# Altium project Circuitry1.PrjPcb
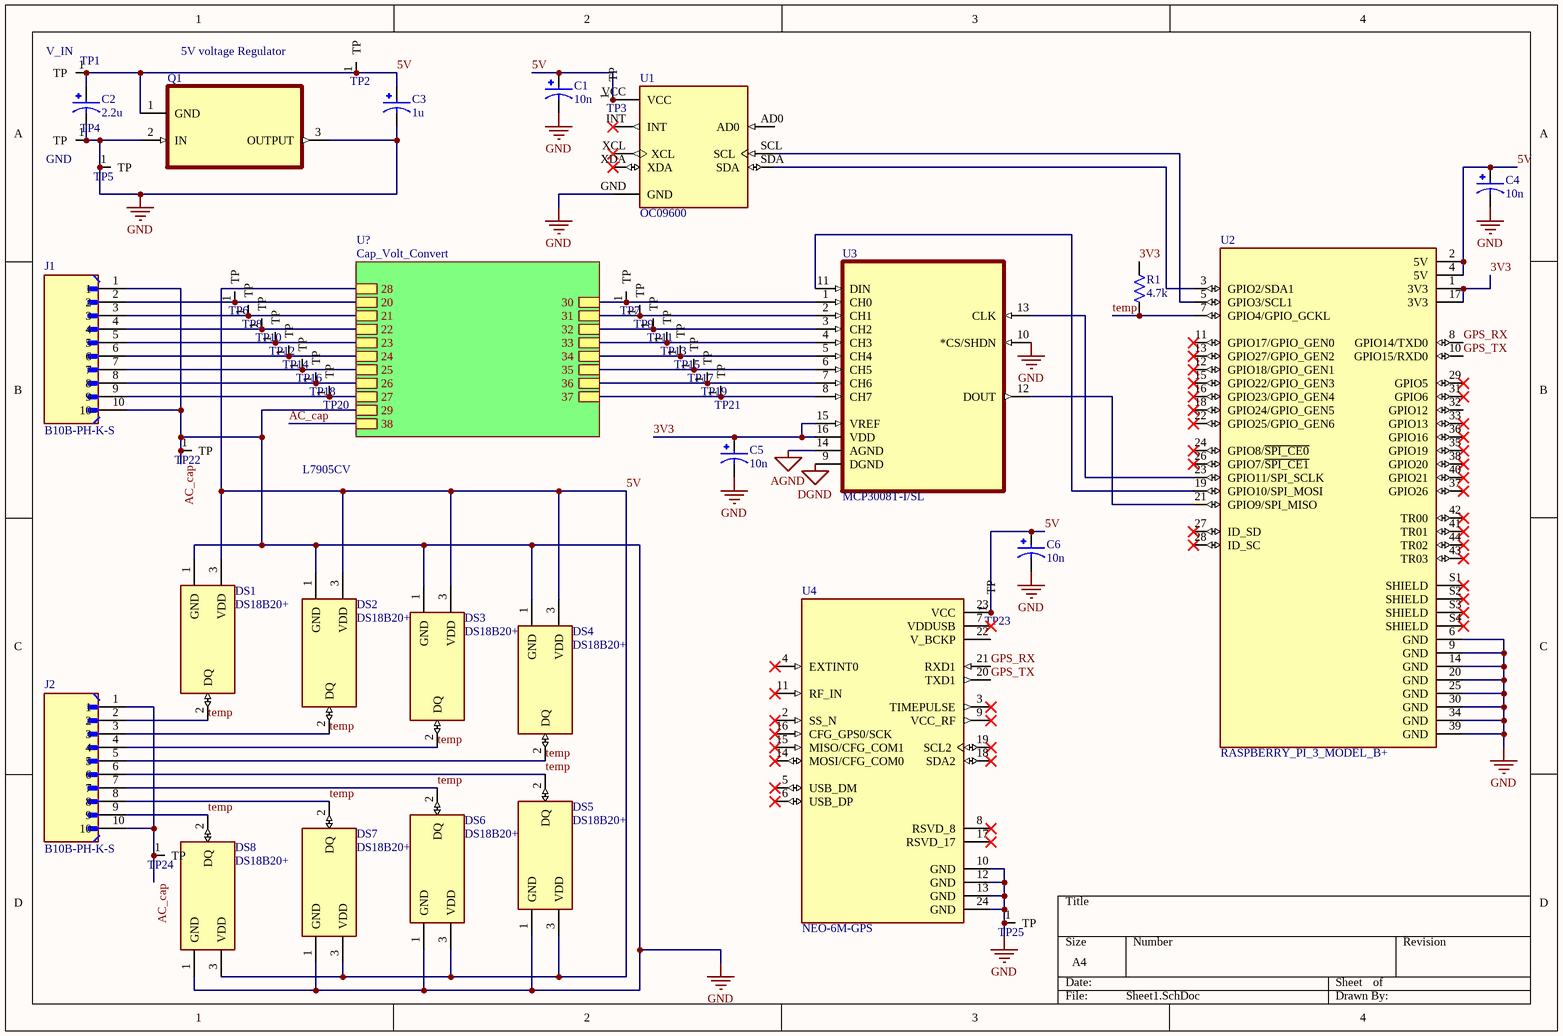
[diagram p0: Sheet1.SchDoc]
3 sheets, 101 parts. Net scope: hierarchical (ports join the sheet entries above them; power ports are global).
Board file: PCB1.PcbDoc
Sheets:
  Sheet1.SchDoc
    U? = Cap_Volt_Convert.SchDoc
      U = High-FrequencyOp-AmpTransimpedanceCircuit.SchDoc
      U = High-FrequencyOp-AmpTransimpedanceCircuit.SchDoc
      U = High-FrequencyOp-AmpTransimpedanceCircuit.SchDoc
      U = High-FrequencyOp-AmpTransimpedanceCircuit.SchDoc
      U = High-FrequencyOp-AmpTransimpedanceCircuit.SchDoc
      U = High-FrequencyOp-AmpTransimpedanceCircuit.SchDoc
      U = High-FrequencyOp-AmpTransimpedanceCircuit.SchDoc
      U = High-FrequencyOp-AmpTransimpedanceCircuit.SchDoc

## Sheet Sheet1.SchDoc
size A4; Author: Samiru Nuwanaka; DrawnBy: Samiru Nuwanaka; Engineer: Samiru Nuwanaka; SheetNumber: 1; SheetTotal: 3

### Parts
C1  10n  [CAPPRD750W80D1600H2000]
C2  2.2u  [CAPPRD750W80D1600H2000]
C3  1u  [CAPPRD750W80D1600H2000]
C4  10n  [CAPPRD750W80D1600H2000]
C5  10n  [CAPPRD750W80D1600H2000]
C6  10n  [CAPPRD750W80D1600H2000]
DS1  DS18B20+  [IC_DS18B20+]
DS2  DS18B20+  [IC_DS18B20+]
DS3  DS18B20+  [IC_DS18B20+]
DS4  DS18B20+  [IC_DS18B20+]
DS5  DS18B20+  [IC_DS18B20+]
DS6  DS18B20+  [IC_DS18B20+]
DS7  DS18B20+  [IC_DS18B20+]
DS8  DS18B20+  [IC_DS18B20+]
J1  B10B-PH-K-S  [JST_B10B-PH-K-S]
J2  B10B-PH-K-S  [JST_B10B-PH-K-S]
Q1  L7905CV  [TO254P450X1020X1935-3P]
R1  4.7k  [RESAD730W45L370D210]
TP1  V_IN  [Testpoint]  (net tie, no BOM)
TP2  Testpoint  [Testpoint SMD]  (value not drawn)  (net tie, no BOM)
TP3  Testpoint  [Testpoint SMD]  (value not drawn)  (net tie, no BOM)
TP4  GND  [Testpoint]  (net tie, no BOM)
TP5  Testpoint  [Testpoint SMD]  (value not drawn)  (net tie, no BOM)
TP6  Testpoint  [Testpoint SMD]  (value not drawn)  (net tie, no BOM)
TP7  Testpoint  [Testpoint SMD]  (value not drawn)  (net tie, no BOM)
TP8  Testpoint  [Testpoint SMD]  (value not drawn)  (net tie, no BOM)
TP9  Testpoint  [Testpoint SMD]  (value not drawn)  (net tie, no BOM)
TP10  Testpoint  [Testpoint SMD]  (value not drawn)  (net tie, no BOM)
TP11  Testpoint  [Testpoint SMD]  (value not drawn)  (net tie, no BOM)
TP12  Testpoint  [Testpoint SMD]  (value not drawn)  (net tie, no BOM)
TP13  Testpoint  [Testpoint SMD]  (value not drawn)  (net tie, no BOM)
TP14  Testpoint  [Testpoint SMD]  (value not drawn)  (net tie, no BOM)
TP15  Testpoint  [Testpoint SMD]  (value not drawn)  (net tie, no BOM)
TP16  Testpoint  [Testpoint SMD]  (value not drawn)  (net tie, no BOM)
TP17  Testpoint  [Testpoint SMD]  (value not drawn)  (net tie, no BOM)
TP18  Testpoint  [Testpoint SMD]  (value not drawn)  (net tie, no BOM)
TP19  Testpoint  [Testpoint SMD]  (value not drawn)  (net tie, no BOM)
TP20  Testpoint  [Testpoint SMD]  (value not drawn)  (net tie, no BOM)
TP21  Testpoint  [Testpoint SMD]  (value not drawn)  (net tie, no BOM)
TP22  Testpoint  [Testpoint]  (value not drawn)  (net tie, no BOM)
TP23  Testpoint  [Testpoint SMD]  (value not drawn)  (net tie, no BOM)
TP24  Testpoint  [Testpoint SMD]  (value not drawn)  (net tie, no BOM)
TP25  Testpoint  [Testpoint SMD]  (value not drawn)  (net tie, no BOM)
U1  OC09600  [MODULE_OC09600]
U2  RASPBERRY_PI_3_MODEL_B+  [MODULE_RASPBERRY_PI_3_MODEL_B+]
U3  MCP3008T-I/SL  [SOIC127P600X175-16N]
U4  NEO-6M-GPS  [XCVR_NEO-6M-GPS]

### Sub-sheets
U? = Cap_Volt_Convert: 20, 21, 22, 23, 24, 25, 26, 27, 28, 29, 30, 31, 32, 33, 34, 35, 36, 37, 38

### Nets
AC_cap: C1.N C2.N C3.N C4.N C5.N C6.N DS1.1(GND) DS2.1(GND) DS3.1(GND) DS4.1(GND) DS5.1(GND) DS6.1(GND) DS7.1(GND) DS8.1(GND) J1.1 J1.10 J2.1 J2.10 Q1.2(IN) Q1.3(OUTPUT) TP4.1(TP) TP5.1(TP) TP22.1(TP) TP24.1(TP) TP25.1(TP) U1.GND U2.6(GND) U2.9(GND) U2.14(GND) U2.20(GND) U2.25(GND) U2.30(GND) U2.34(GND) U2.39(GND) U3.10(*CS/SHDN) U4.10(GND) U4.12(GND) U4.13(GND) U4.24(GND) ; sheet U?/29, sheet U?/38  [also labelled GND]
AGND: U3.14(AGND)
DGND: U3.9(DGND)
3V3: C5.P R1.2 U2.1(3V3) U2.17(3V3) U3.15(VREF) U3.16(VDD)
5V: C1.P C2.P C3.P C4.P C6.P DS1.3(VDD) DS2.3(VDD) DS3.3(VDD) DS4.3(VDD) DS5.3(VDD) DS6.3(VDD) DS7.3(VDD) DS8.3(VDD) Q1.1(GND) TP1.1(TP) TP2.1(TP) TP3.1(TP) TP23.1(TP) U1.VCC U2.2(5V) U2.4(5V) U4.23(VCC) ; sheet U?/28
GPS_RX: U2.8(GPIO14/TXD0) U4.21(RXD1)
GPS_TX: U2.10(GPIO15/RXD0) U4.20(TXD1)
temp: DS1.2(DQ) DS2.2(DQ) DS3.2(DQ) DS4.2(DQ) DS5.2(DQ) DS6.2(DQ) DS7.2(DQ) DS8.2(DQ) J2.2 J2.3 J2.4 J2.5 J2.6 J2.7 J2.8 J2.9 R1.1 U2.7(GPIO4/GPIO_GCKL)
NetC10_U?_U#1_P: J1.2 TP6.1(TP) ; sheet U?/20
NetC10_U?_U#3_P: J1.6 TP14.1(TP) ; sheet U?/24
NetC10_U?_U#4_P: J1.7 TP16.1(TP) ; sheet U?/25
NetC10_U?_U#5_P: J1.8 TP18.1(TP) ; sheet U?/26
NetC10_U?_U#6_P: J1.9 TP20.1(TP) ; sheet U?/27
NetC10_U?_U#7_P: J1.3 TP8.1(TP) ; sheet U?/21
NetC10_U?_U#8_P: J1.5 TP12.1(TP) ; sheet U?/23
NetC11_U?_U#1_P: TP7.1(TP) U3.1(CH0) ; sheet U?/30
NetC11_U?_U#2_P: TP11.1(TP) U3.3(CH2) ; sheet U?/32
NetC11_U?_U#3_P: TP15.1(TP) U3.5(CH4) ; sheet U?/34
NetC11_U?_U#4_P: TP17.1(TP) U3.6(CH5) ; sheet U?/35
NetC11_U?_U#5_P: TP19.1(TP) U3.7(CH6) ; sheet U?/36
NetC11_U?_U#6_P: TP21.1(TP) U3.8(CH7) ; sheet U?/37
NetC11_U?_U#7_P: TP9.1(TP) U3.2(CH1) ; sheet U?/31
NetC11_U?_U#8_P: TP13.1(TP) U3.4(CH3) ; sheet U?/33
NetJ1_4: J1.4 TP10.1(TP) ; sheet U?/22
NetU1_SCL: U1.SCL U2.5(GPIO3/SCL1)
NetU1_SDA: U1.SDA U2.3(GPIO2/SDA1)
NetU2_19: U2.19(GPIO10/SPI_MOSI) U3.11(DIN)
NetU2_21: U2.21(GPIO9/SPI_MISO) U3.12(DOUT)
NetU2_23: U2.23(GPIO11/SPI_SCLK) U3.13(CLK)

Not connected (* = marked no-connect by the designer): U1 AD0 INT* XCL* XDA*; U2 11(GPIO17/GPIO_GEN0)* 12(GPIO18/GPIO_GEN1)* 13(GPIO27/GPIO_GEN2)* 15(GPIO22/GPIO_GEN3)* 16(GPIO23/GPIO_GEN4)* 18(GPIO24/GPIO_GEN5)* 22(GPIO25/GPIO_GEN6)* 24(GPIO8/~{SPI_CE0})* 26(GPIO7/~{SPI_CE1})* 27(ID_SD)* 28(ID_SC)* 29(GPIO5)* 31(GPIO6)* 32(GPIO12) 33(GPIO13)* 35(GPIO19)* 36(GPIO16)* 37(GPIO26)* 38(GPIO20)* 40(GPIO21)* 41(TR01)* 42(TR00)* 43(TR03)* 44(TR02)* S1(SHIELD)* S2(SHIELD)* S3(SHIELD)* S4(SHIELD)*; U4 2(SS_N)* 3(TIMEPULSE)* 4(EXTINT0)* 5(USB_DM)* 6(USB_DP)* 7(VDDUSB)* 8(RSVD_8)* 9(VCC_RF)* 11(RF_IN)* 14(MOSI/CFG_COM0)* 15(MISO/CFG_COM1)* 16(CFG_GPS0/SCK)* 17(RSVD_17)* 18(SDA2)* 19(SCL2)* 22(V_BCKP)

### Notes on the sheet
- 5V voltage Regulator

### Library data of the parts
C1-C6 = EEUFS1J681S: CAP ALUM 680UF 20% 63V THRU HOLE; MP: EEU-FS1J681S; MF: Panasonic Electronic Components; Package: RADIAL-2 Panasonic; Availability: In Stock; SnapEDA_Link: https://www.snapeda.com/parts/EEU-FS1J681S/Panasonic/view-part/5562022/?ref=snap; Price: None; Check_prices: https://www.snapeda.com/parts/EEU-FS1J681S/Panasonic/view-part/5562022/?ref=eda; Value: *
DS1-DS8 = DS18B20+: Programmable Resolution 1-Wire Digital Thermometer; MF: Analog Devices; SnapEDA_Link: https://www.snapeda.com/parts/DS18B20+/Analog+Devices/view-part/?ref=snap; Package: TO-226-3 Maxim; Value: *; MP: DS18B20+; Check_prices: https://www.snapeda.com/parts/DS18B20+/Analog+Devices/view-part/?ref=eda
J1 J2 = B10B-PH-K-S: 2.0 mm pitch/Disconnectable Crimp style connectors; MF: JST Sales America Inc.; SnapEDA_Link: https://www.snapeda.com/parts/B10B-PH-K-S/JST/view-part/?ref=snap; Package: None; Value: *; MP: B10B-PH-K-S; Check_prices: https://www.snapeda.com/parts/B10B-PH-K-S/JST/view-part/?ref=eda
Q1 = L7905CV: Linear Voltage Regulator IC Negative Fixed 1 Output 1.5A TO-220; MF: STMicroelectronics; SnapEDA_Link: https://www.snapeda.com/parts/L7905CV/STMicroelectronics/view-part/?ref=snap; Package: TO-220-3 STMicroelectronics; Value: *; MP: L7905CV; Check_prices: https://www.snapeda.com/parts/L7905CV/STMicroelectronics/view-part/?ref=eda
R1 = MFR-12FTE52-12K5: Metal Film Resistors - Through Hole; MF: YAGEO; SnapEDA_Link: https://www.snapeda.com/parts/MFR-12FTE52-12K5/Yageo/view-part/?ref=snap; Package: RADIAL-2 Yageo; Value: *; MP: MFR-12FTE52-12K5; Check_prices: https://www.snapeda.com/parts/MFR-12FTE52-12K5/Yageo/view-part/?ref=eda
TP1 TP4 = Testpoint
U1 = OC09600: GY-521 6 DOF MPU-6050 Module 3 Axis Accelerometer Gyroscope Module for Arduino; MF: YKS; SnapEDA_Link: https://www.snapeda.com/parts/OC09600/YKS/view-part/?ref=snap; Package: None; Value: *; MP: OC09600; Check_prices: https://www.snapeda.com/parts/OC09600/YKS/view-part/?ref=eda
U2 = RASPBERRY_PI_3_MODEL_B+: Case Plastic, ABS Black Hand Held, Split Sides 3.520 L x 2.740 W (89.41mm x 69.60mm) X 0.980 (24.89mm); MF: Raspberry Pi; MP: RASPBERRY PI 3 MODEL B+; Purchase-URL: https://pricing.snapeda.com/search/part/RASPBERRY PI 3 MODEL B+/?ref=eda; Check_prices: https://www.snapeda.com/parts/RASPBERRY%20PI%203%20MODEL%20B+/Raspberry+Pi/view-part/?ref=eda; SnapEDA_Link: https://www.snapeda.com/parts/RASPBERRY%20PI%203%20MODEL%20B+/Raspberry+Pi/view-part/?ref=snap; Price: None; Availability: In Stock; Package: Raspberry Pi; Value: *
U3 = MCP3008T-I/SL: 10-bit ADC, SPI, 8-channel16 SOIC .150in T/R | Microchip Technology Inc. MCP3008T-I/SL; SnapEDA_Link: https://www.snapeda.com/parts/MCP3008T-I/SL/Microchip/view-part/?ref=snap; Package: SOIC-16 Microchip; Value: *; MF: Microchip Technology; MP: MCP3008T-I/SL; Check_prices: https://www.snapeda.com/parts/MCP3008T-I/SL/Microchip/view-part/?ref=eda
U4 = NEO-6M-GPS: GPS Development Tools SparkFun GNSS-RTK Dead Reckoning Breakout - ZED-F9K (Qwiic); MF: u-blox; SnapEDA_Link: https://www.snapeda.com/parts/NEO-6M-GPS/u-blox/view-part/?ref=snap; MP: NEO-6M-GPS; Availability: Not in stock; Price: None; Check_prices: https://www.snapeda.com/parts/NEO-6M-GPS/u-blox/view-part/?ref=eda; Value: *; Package: None

## Sheet Cap_Volt_Convert.SchDoc
size A4; SheetNumber: 2; SheetTotal: 3
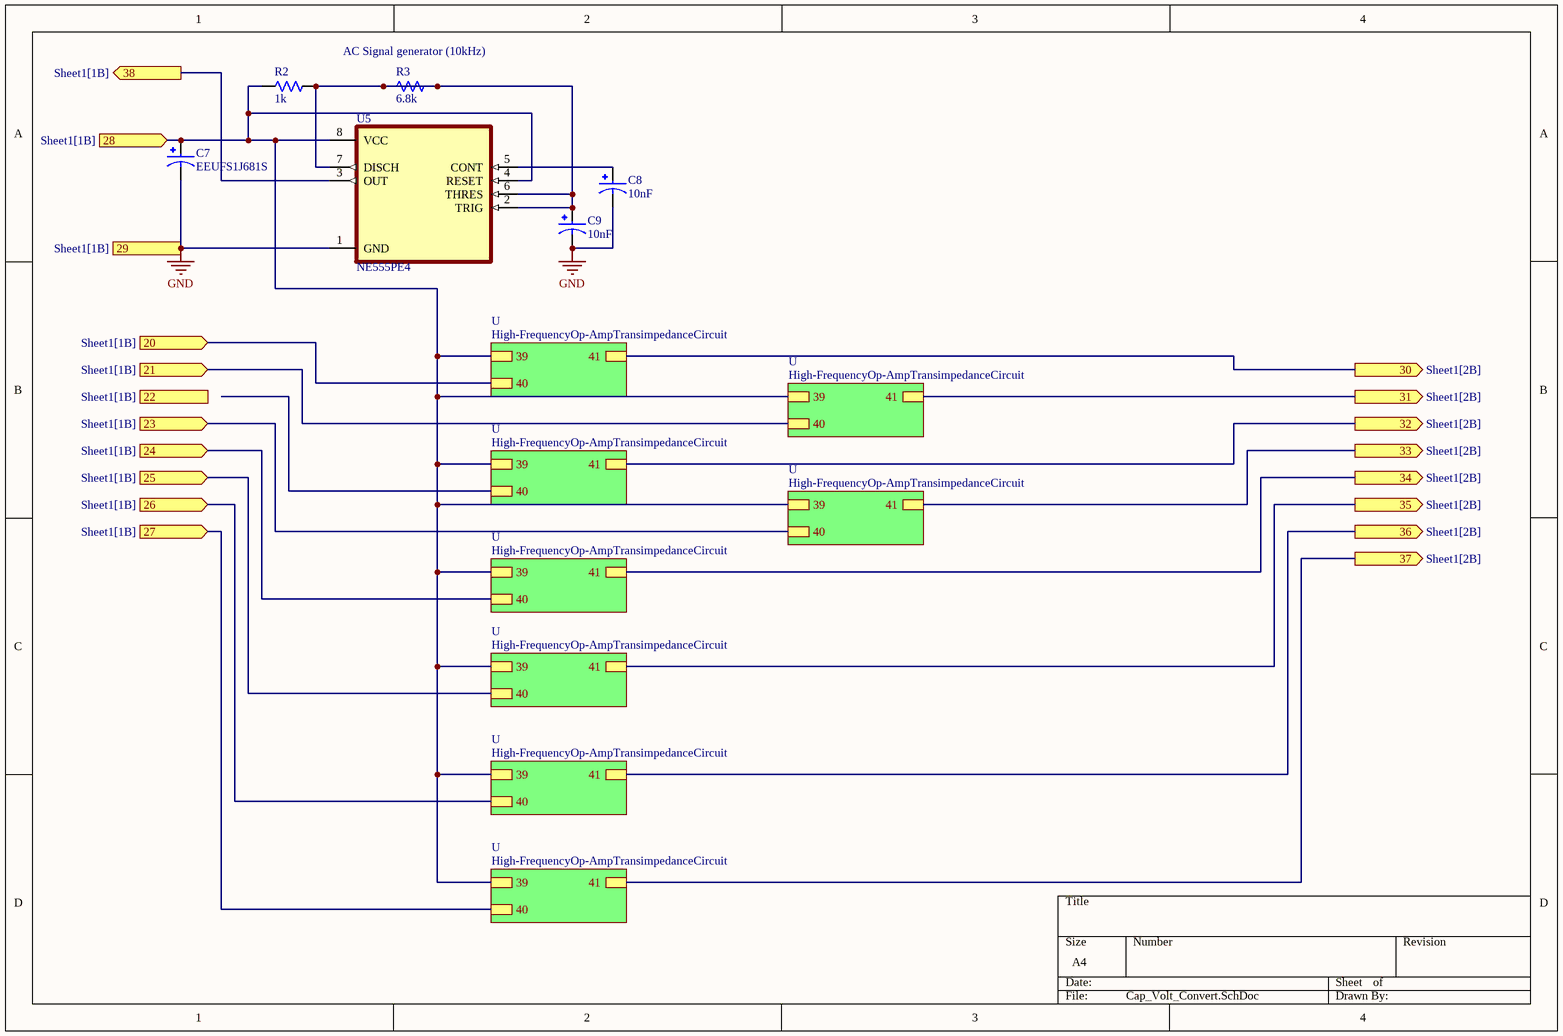
[diagram p1: Cap_Volt_Convert.SchDoc]

### Parts
C7  EEUFS1J681S  [CAPPRD750W80D1600H2000]
C8  10nF  [CAPPRD750W80D1600H2000]
C9  10nF  [CAPPRD750W80D1600H2000]
R2  1k  [RESAD730W45L370D210]
R3  6.8k  [RESAD730W45L370D210]
U5  NE555PE4  [DIP794W45P254L959H508Q8]

### Sub-sheets
U = High-FrequencyOp-AmpTransimpedanceCircuit: 39, 40, 41
U = High-FrequencyOp-AmpTransimpedanceCircuit: 39, 40, 41
U = High-FrequencyOp-AmpTransimpedanceCircuit: 39, 40, 41
U = High-FrequencyOp-AmpTransimpedanceCircuit: 39, 40, 41
U = High-FrequencyOp-AmpTransimpedanceCircuit: 39, 40, 41
U = High-FrequencyOp-AmpTransimpedanceCircuit: 39, 40, 41
U = High-FrequencyOp-AmpTransimpedanceCircuit: 39, 40, 41
U = High-FrequencyOp-AmpTransimpedanceCircuit: 39, 40, 41

### Ports
20 (in, see Sheet1[1B]), 21 (in, see Sheet1[1B]), 22 (in, see Sheet1[1B]), 23 (in, see Sheet1[1B]), 24 (in, see Sheet1[1B]), 25 (in, see Sheet1[1B]), 26 (in, see Sheet1[1B]), 27 (in, see Sheet1[1B]), 28 (in, see Sheet1[1B]), 29 (in, see Sheet1[1B]), 30 (out, see Sheet1[2B]), 31 (out, see Sheet1[2B]), 32 (out, see Sheet1[2B]), 33 (out, see Sheet1[2B]), 34 (out, see Sheet1[2B]), 35 (out, see Sheet1[2B]), 36 (out, see Sheet1[2B]), 37 (out, see Sheet1[2B]), 38 (out, see Sheet1[1B])

### Nets
GND: C7.N C8.N C9.N U5.1(GND) U5.3(OUT) ; port 29, port 38  [project net AC_cap]
5V: C7.P R2.2 U5.4(RESET) U5.8(VCC) ; port 28, sheet U/39, sheet U/39, sheet U/39, sheet U/39, sheet U/39, sheet U/39, sheet U/39, sheet U/39
NetC8_P: C8.P U5.5(CONT)
NetC9_P: C9.P R2.1 R3.1 R3.2 U5.2(TRIG) U5.6(THRES) U5.7(DISCH)
NetC10_U?_U#1_P: port 20, sheet U/40
NetC10_U?_U#3_P: port 24, sheet U/40
NetC10_U?_U#4_P: port 25, sheet U/40
NetC10_U?_U#5_P: port 26, sheet U/40
NetC10_U?_U#6_P: port 27, sheet U/40
NetC10_U?_U#7_P: port 21, sheet U/40
NetC10_U?_U#8_P: port 23, sheet U/40
NetC11_U?_U#1_P: port 30, sheet U/41
NetC11_U?_U#2_P: port 32, sheet U/41
NetC11_U?_U#3_P: port 34, sheet U/41
NetC11_U?_U#4_P: port 35, sheet U/41
NetC11_U?_U#5_P: port 36, sheet U/41
NetC11_U?_U#6_P: port 37, sheet U/41
NetC11_U?_U#7_P: port 31, sheet U/41
NetC11_U?_U#8_P: port 33, sheet U/41

### Notes on the sheet
- (near R3) AC Signal generator (10kHz)

### Library data of the parts
C7-C9 = EEUFS1J681S: as C1 on sheet Sheet1; Package: RADIAL-2 Panasonic; Availability: In Stock; SnapEDA_Link: https://www.snapeda.com/parts/EEU-FS1J681S/Panasonic/view-part/5562022/?ref=snap; Price: None; Check_prices: https://www.snapeda.com/parts/EEU-FS1J681S/Panasonic/view-part/5562022/?ref=eda; Value: *
R2 R3 = MFR-12FTE52-12K5: as R1 on sheet Sheet1; SnapEDA_Link: https://www.snapeda.com/parts/MFR-12FTE52-12K5/Yageo/view-part/?ref=snap; Package: RADIAL-2 Yageo; Value: *; MP: MFR-12FTE52-12K5; Check_prices: https://www.snapeda.com/parts/MFR-12FTE52-12K5/Yageo/view-part/?ref=eda
U5 = NE555PE4: Single Precision Timer; MF: Texas Instruments; SnapEDA_Link: https://www.snapeda.com/parts/NE555PE4/Texas+Instruments/view-part/?ref=snap; Package: PDIP-8 Texas; Value: *; MP: NE555PE4; Check_prices: https://www.snapeda.com/parts/NE555PE4/Texas+Instruments/view-part/?ref=eda

## Sheet High-FrequencyOp-AmpTransimpedanceCircuit.SchDoc
size A4; SheetNumber: 3; SheetTotal: 3
Used 8 times, as channels U?/U, U?/U, U?/U, U?/U, U?/U, U?/U, U?/U, U?/U. Parts and nets are listed once, with the designators drawn on the sheet.
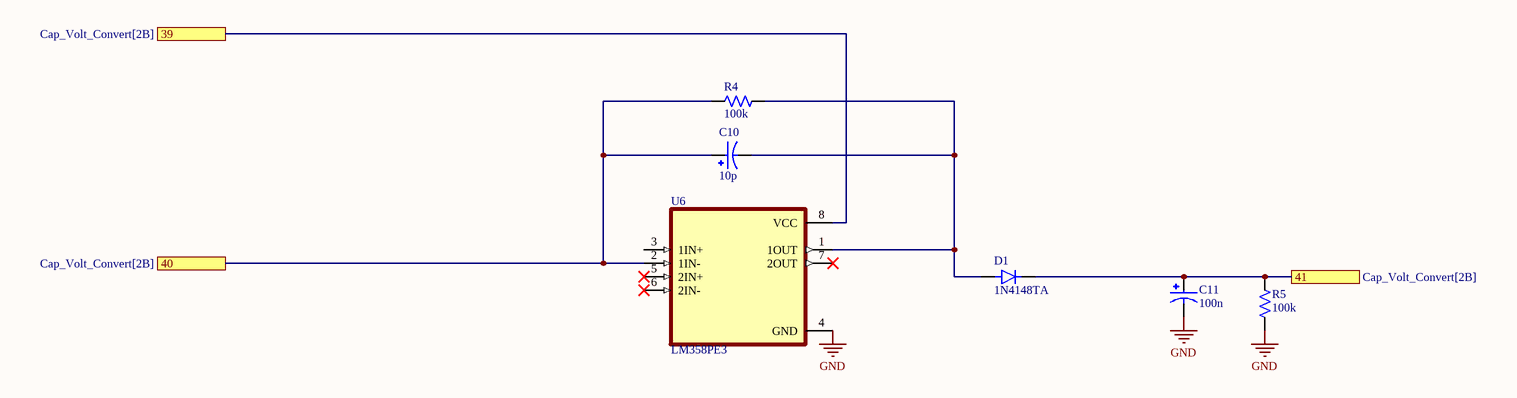
[diagram p2: High-FrequencyOp-AmpTransimpedanceCircuit.SchDoc]

### Parts
C10  10p  [CAPPRD750W80D1600H2000]
C11  100n  [CAPPRD750W80D1600H2000]
D1  1N4148TA  [DIOAD753W49L380D172B]
R4  100k  [RESAD730W45L370D210]
R5  100k  [RESAD730W45L370D210]
U6  LM358PE3  [DIP794W45P254L959H508Q8 - duplicate]

### Ports
39 (see Cap_Volt_Convert[2B]), 40 (see Cap_Volt_Convert[2B]), 41 (see Cap_Volt_Convert[2B])

### Nets
GND: C11.N R5.1 U6.4(GND)
39: U6.8(VCC) ; port 39
40: C10.P R4.1 U6.2(1IN-) ; port 40
41: C11.P D1.K R5.2 ; port 41
NetC10_N: C10.N D1.A R4.2 U6.1(1OUT)

Not connected (* = marked no-connect by the designer): U6 3(1IN+) 5(2IN+)* 6(2IN-)* 7(2OUT)*

### Channels
U?/U: designators end in _U?_U#1; ports 39=5V 40=NetC10_U?_U#1_P 41=NetC11_U?_U#1_P
U?/U: designators end in _U?_U#2; ports 39=5V 40=NetC10_U?_U#2_P 41=NetC11_U?_U#2_P
U?/U: designators end in _U?_U#3; ports 39=5V 40=NetC10_U?_U#3_P 41=NetC11_U?_U#3_P
U?/U: designators end in _U?_U#4; ports 39=5V 40=NetC10_U?_U#4_P 41=NetC11_U?_U#4_P
U?/U: designators end in _U?_U#5; ports 39=5V 40=NetC10_U?_U#5_P 41=NetC11_U?_U#5_P
U?/U: designators end in _U?_U#6; ports 39=5V 40=NetC10_U?_U#6_P 41=NetC11_U?_U#6_P
U?/U: designators end in _U?_U#7; ports 39=5V 40=NetC10_U?_U#7_P 41=NetC11_U?_U#7_P
U?/U: designators end in _U?_U#8; ports 39=5V 40=NetC10_U?_U#8_P 41=NetC11_U?_U#8_P

### Library data of the parts
C10 C11 = EEUFS1J681S: as C1 on sheet Sheet1; Package: RADIAL-2 Panasonic; Availability: In Stock; SnapEDA_Link: https://www.snapeda.com/parts/EEU-FS1J681S/Panasonic/view-part/5562022/?ref=snap; Price: None; Check_prices: https://www.snapeda.com/parts/EEU-FS1J681S/Panasonic/view-part/5562022/?ref=eda; Value: *
D1 = 1N4148TA: Diode Standard 100 V 200mA Through Hole DO-35; MF: ON Semiconductor; SnapEDA_Link: https://www.snapeda.com/parts/1N4148TA/Onsemi/view-part/?ref=snap; Package: AXIAL LEAD-2 ON Semiconductor; Value: *; MP: 1N4148TA; Check_prices: https://www.snapeda.com/parts/1N4148TA/Onsemi/view-part/?ref=eda
R4 R5 = MFR-12FTE52-12K5: as R1 on sheet Sheet1; SnapEDA_Link: https://www.snapeda.com/parts/MFR-12FTE52-12K5/Yageo/view-part/?ref=snap; Package: RADIAL-2 Yageo; Value: *; MP: MFR-12FTE52-12K5; Check_prices: https://www.snapeda.com/parts/MFR-12FTE52-12K5/Yageo/view-part/?ref=eda
U6 = LM358PE3: Dual, 30-V, 700-kHz operational amplifier; MF: Texas Instruments; SnapEDA_Link: https://www.snapeda.com/parts/LM358PE3/Texas+Instruments/view-part/?ref=snap; Package: PDIP-8 Texas; Value: *; MP: LM358PE3; Check_prices: https://www.snapeda.com/parts/LM358PE3/Texas+Instruments/view-part/?ref=eda

## Nets that join several sheets
AC_cap: Sheet1 (39 pins), Cap_Volt_Convert (5 pins), U?/U (C11_U?_U#1.N R5_U?_U#1.1 U6_U?_U#1.4), U?/U (C11_U?_U#2.N R5_U?_U#2.1 U6_U?_U#2.4), U?/U (C11_U?_U#3.N R5_U?_U#3.1 U6_U?_U#3.4), U?/U (C11_U?_U#4.N R5_U?_U#4.1 U6_U?_U#4.4), U?/U (C11_U?_U#5.N R5_U?_U#5.1 U6_U?_U#5.4), U?/U (C11_U?_U#6.N R5_U?_U#6.1 U6_U?_U#6.4), U?/U (C11_U?_U#7.N R5_U?_U#7.1 U6_U?_U#7.4), U?/U (C11_U?_U#8.N R5_U?_U#8.1 U6_U?_U#8.4)
5V: Sheet1 (22 pins), Cap_Volt_Convert (C7.P R2.2 U5.4 U5.8), U?/U (U6_U?_U#1.8), U?/U (U6_U?_U#2.8), U?/U (U6_U?_U#3.8), U?/U (U6_U?_U#4.8), U?/U (U6_U?_U#5.8), U?/U (U6_U?_U#6.8), U?/U (U6_U?_U#7.8), U?/U (U6_U?_U#8.8)
NetC10_U?_U#1_P: Sheet1 (J1.2 TP6.1), U?/U (C10_U?_U#1.P R4_U?_U#1.1 U6_U?_U#1.2)
NetC10_U?_U#3_P: Sheet1 (J1.6 TP14.1), U?/U (C10_U?_U#3.P R4_U?_U#3.1 U6_U?_U#3.2)
NetC10_U?_U#4_P: Sheet1 (J1.7 TP16.1), U?/U (C10_U?_U#4.P R4_U?_U#4.1 U6_U?_U#4.2)
NetC10_U?_U#5_P: Sheet1 (J1.8 TP18.1), U?/U (C10_U?_U#5.P R4_U?_U#5.1 U6_U?_U#5.2)
NetC10_U?_U#6_P: Sheet1 (J1.9 TP20.1), U?/U (C10_U?_U#6.P R4_U?_U#6.1 U6_U?_U#6.2)
NetC10_U?_U#7_P: Sheet1 (J1.3 TP8.1), U?/U (C10_U?_U#7.P R4_U?_U#7.1 U6_U?_U#7.2)
NetC10_U?_U#8_P: Sheet1 (J1.5 TP12.1), U?/U (C10_U?_U#8.P R4_U?_U#8.1 U6_U?_U#8.2)
NetC11_U?_U#1_P: Sheet1 (TP7.1 U3.1), U?/U (C11_U?_U#1.P D1_U?_U#1.K R5_U?_U#1.2)
NetC11_U?_U#2_P: Sheet1 (TP11.1 U3.3), U?/U (C11_U?_U#2.P D1_U?_U#2.K R5_U?_U#2.2)
NetC11_U?_U#3_P: Sheet1 (TP15.1 U3.5), U?/U (C11_U?_U#3.P D1_U?_U#3.K R5_U?_U#3.2)
NetC11_U?_U#4_P: Sheet1 (TP17.1 U3.6), U?/U (C11_U?_U#4.P D1_U?_U#4.K R5_U?_U#4.2)
NetC11_U?_U#5_P: Sheet1 (TP19.1 U3.7), U?/U (C11_U?_U#5.P D1_U?_U#5.K R5_U?_U#5.2)
NetC11_U?_U#6_P: Sheet1 (TP21.1 U3.8), U?/U (C11_U?_U#6.P D1_U?_U#6.K R5_U?_U#6.2)
NetC11_U?_U#7_P: Sheet1 (TP9.1 U3.2), U?/U (C11_U?_U#7.P D1_U?_U#7.K R5_U?_U#7.2)
NetC11_U?_U#8_P: Sheet1 (TP13.1 U3.4), U?/U (C11_U?_U#8.P D1_U?_U#8.K R5_U?_U#8.2)